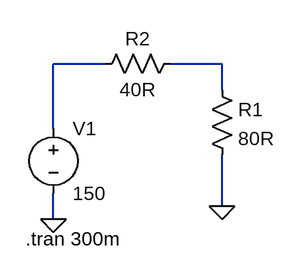
[diagram p0: schematic voltage divider 1.asc]
voltage divider 1.asc, the LTspice schematic file:
Version 4
SHEET 1 880 680
WIRE 112 80 48 80
WIRE 256 80 192 80
WIRE 256 112 256 80
WIRE 48 160 48 80
WIRE 256 256 256 192
WIRE 48 272 48 240
FLAG 256 256 0
FLAG 48 272 0
SYMBOL res 240 96 R0
SYMATTR InstName R1
SYMATTR Value 80R
SYMBOL res 208 64 R90
WINDOW 0 0 56 VBottom 2
WINDOW 3 32 56 VTop 2
SYMATTR InstName R2
SYMATTR Value 40R
SYMBOL voltage 48 144 R0
WINDOW 123 0 0 Left 0
WINDOW 39 0 0 Left 0
SYMATTR InstName V1
SYMATTR Value 150
TEXT 14 296 Left 2 !.tran 300m

The netlist it stands for:
* voltage divider 1.asc
R1 N002 0 80R
R2 N002 N001 40R
V1 N001 0 150
.tran 300m
.backanno
.end